# Altium schematic sheet power.SchDoc
size Letter
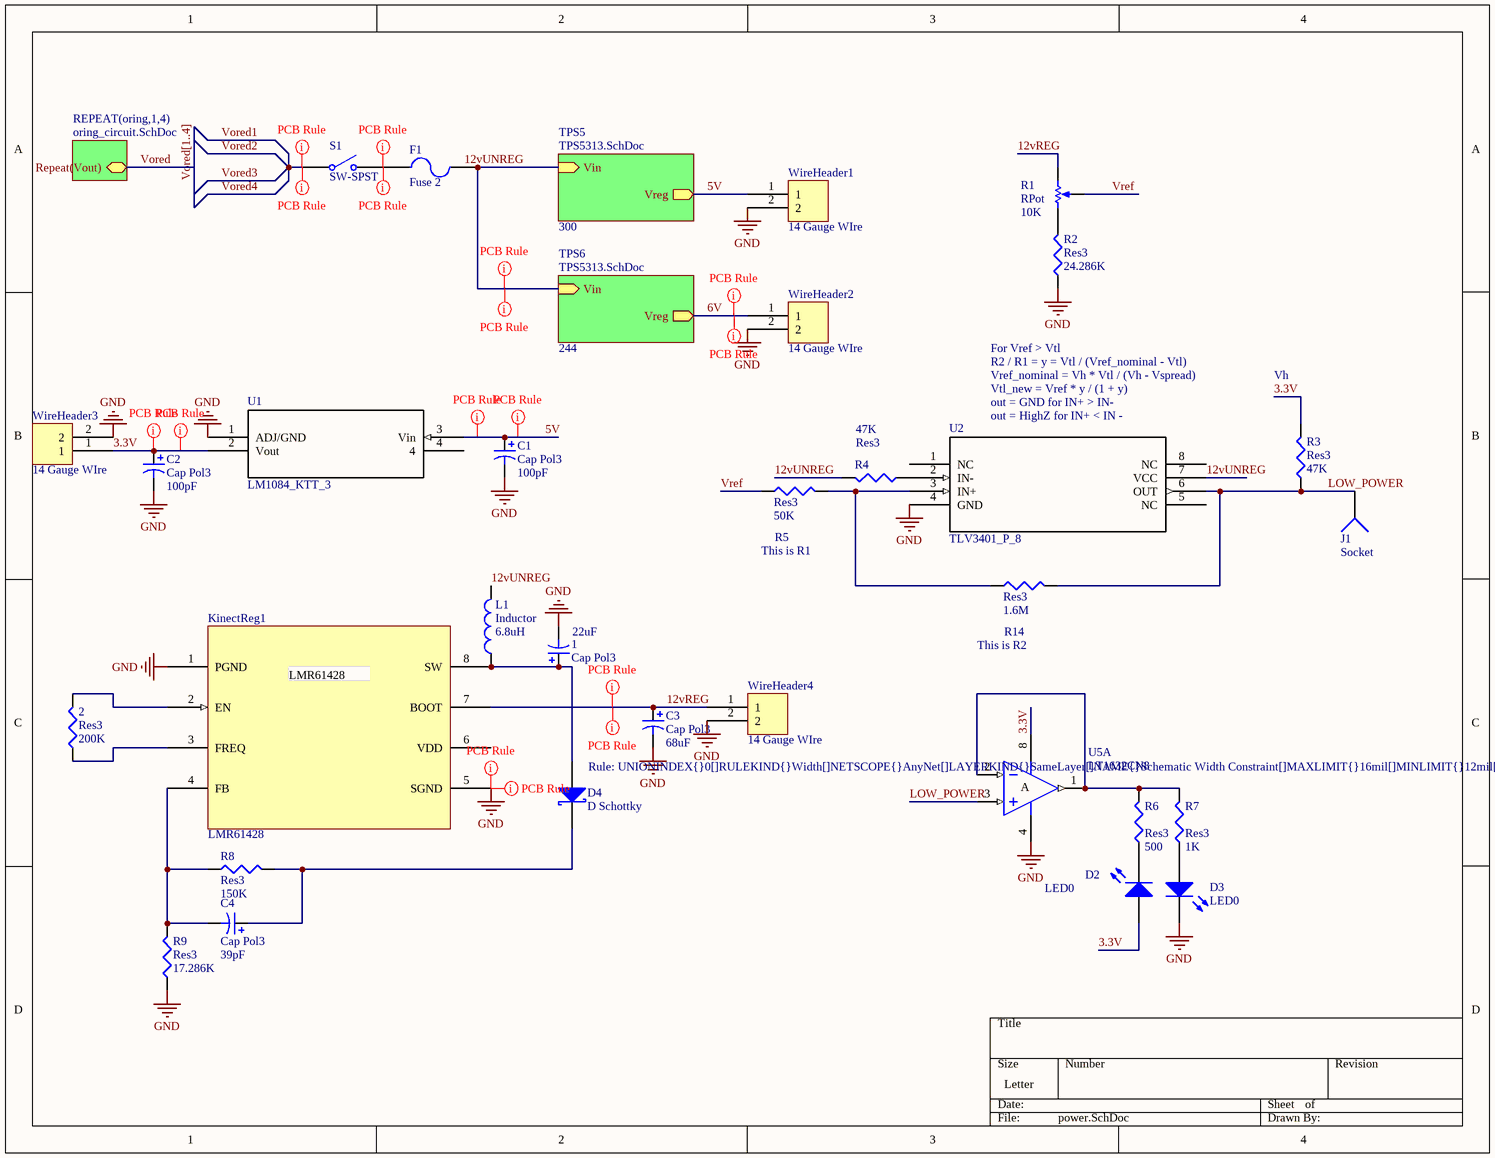
[diagram p0: power.SchDoc]

## Parts
1  Cap Pol3  value 22uF  [C0805]
2  Res3  value 200K  [6-0805_M]
C1  Cap Pol3  value 100pF  [C0805]
C2  Cap Pol3  value 100pF  [C0805]
C3  Cap Pol3  value 68uF  [C0805]
C4  Cap Pol3  value 39pF  [C0805]
D2  LED0  [LED-0]
D3  LED0  [LED-0]
D4  D Schottky  [AXIAL-0.3]
F1  Fuse 2  [PIN-W2/E2.8]
J1  Socket  [PIN1]
KinectReg1  LMR61428  [D8]
L1  Inductor  value 6.8uH  [6-0805_L]
R1  RPot  value 10K  [RPot]
R2  Res3  value 24.286K  [6-0805_M]
R3  Res3  value 47K  [6-0805_M]
R4  Res3  value 47K  [6-0805_M]
R5  Res3  value 50K  [6-0805_M]
R6  Res3  value 500  [6-0805_M]
R7  Res3  value 1K  [6-0805_M]
R8  Res3  value 150K  [6-0805_M]
R9  Res3  value 17.286K  [6-0805_M]
R14  Res3  value 1.6M  [6-0805_M]
S1  SW-SPST  [switch]
U1  LM1084_KTT_3  [TS3B]
U2  TLV3401_P_8  [P8]
U5  LT1632CN8  [P8]  (part A of 2)
WireHeader1  14 Gauge WIre  [WireHeader]
WireHeader2  14 Gauge WIre  [WireHeader]
WireHeader3  14 Gauge WIre  [WireHeader]
WireHeader4  14 Gauge WIre  [WireHeader]

## Sub-sheets
REPEAT(oring,1,4) = oring_circuit.SchDoc: Repeat(Vout)
TPS5 = TPS5313.SchDoc: Vreg (out), Vin (in)  | R2_Value: 300
TPS6 = TPS5313.SchDoc: Vreg (out), Vin (in)  | R2_Value: 244

## Nets
GND: 1.2 C1.2 C2.2 C3.2 D3.2(K) KinectReg1.1(PGND) KinectReg1.5(SGND) R2.1 R9.1 U1.1(ADJ/GND) U2.4(GND) U5.4(V-) WireHeader1.2 WireHeader2.2 WireHeader3.2 WireHeader4.2
3.3V: C2.1 D2.1(A) R3.2 U1.2(Vout) U5.8(V+) WireHeader3.1
5V: C1.1 U1.3(Vin) WireHeader1.1 ; sheet TPS5/Vreg
6V: WireHeader2.1 ; sheet TPS6/Vreg
12vREG: C3.1 KinectReg1.7(BOOT) R1.2(BOT) WireHeader4.1
12vUNREG: L1.2 R4.2 U2.7(VCC)
LOW_POWER: J1.1 R3.1 R14.2 U2.6(OUT) U5.3(IN+)
Vored: sheet REPEAT(oring,1,4)/Repeat(Vout)
Vored1: S1.1(COMMON)  [also labelled Vored2, Vored3, Vored4]
Vref: R1.3(TAP) R5.1
Net1_1: 1.1 D4.1(A) KinectReg1.8(SW) L1.1
Net2_1: 2.1 KinectReg1.3(FREQ)
Net2_2: 2.2 KinectReg1.2(EN)
NetC4_1: C4.1 D4.2(K) R8.2
NetC4_2: C4.2 KinectReg1.4(FB) R8.1 R9.2
NetD2_2: D2.2(K) R6.1
NetD3_1: D3.1(A) R7.1
NetF1_1: F1.1 S1.2(NO)
NetF1_2: F1.2 ; sheet TPS5/Vin, sheet TPS6/Vin
NetR1_1: R1.1(TOP) R2.2
NetR4_1: R4.1 U2.2(IN-)
NetR5_2: R5.2 R14.1 U2.3(IN+)
NetR6_2: R6.2 R7.2 U5.1(OUT) U5.2(IN-)

Not connected (* = marked no-connect by the designer): KinectReg1 6(VDD); U1 4; U2 1(NC) 5(NC) 8(NC)

## Buses and harness runs
bus Vored[1..4]

## Layout directives
rule Width Constraint [Pref Width = 15mil    Min Width = 12mil    Max Width = 16mil]: 12vREG
rule Undefined; rule Width Constraint [Pref Width = 30mil    Min Width = 30mil    Max Width = 30mil]: 3.3V
rule Width Constraint [Pref Width = 40mil    Min Width = 40mil    Max Width = 40mil]: 5V, 6V, NetF1_1, NetF1_2, Vored1
rule Width Constraint [Pref Width = 15mil    Min Width = 15mil    Max Width = 15mil]: GND
rule Undefined; rule Clearance Constraint [Clearance = 30mil]: 3.3V, 5V, 6V, 12vREG, GND, NetF1_1, NetF1_2, Vored1

## Notes on the sheet
- R2 / R1 = y = Vtl / (Vref_nominal - Vtl)
- For Vref > Vtl
- out = GND for IN+ > IN-
- (near U2) out = HighZ for IN+ < IN -
- Vtl_new = Vref * y / (1 + y)
- Vref_nominal = Vh * Vtl / (Vh - Vspread)
- Vh
- This is R1
- This is R2
- Labels drawn without touching a wire or pin: 12vUNREG
- (in symbol LT1632CN8, part A) A

## Library data of the parts
1 C1-C4 = Cap Pol3: Polarized Capacitor (Surface Mount); Published: 8-Jun-2000; LatestRevisionDate: 29-May-2009; LatestRevisionNote: IPC-7351 Footprint Added.; PackageReference: C0805; Publisher: Altium Limited; PackageDescription: Chip Capacitor
2 R2-R9 R14 = Res3: Resistor; Published: 8-Jun-2000; LatestRevisionDate: 29-May-2009; LatestRevisionNote: IPC-7351 Footprint Added.; PackageReference: J1-0603; Publisher: Altium Limited; PackageDescription: Chip Resistor
D2 D3 = LED0: Typical INFRARED GaAs LED; Published: 8-Jun-2000; LatestRevisionDate: 08-Jul-2005; LatestRevisionNote: Mech Layer 1 removed.; PackageReference: LED-0; Publisher: Altium Limited; PackageDescription: LED; 2 Leads
D4 = D Schottky: Schottky Diode; Published: 8-Jun-2000; LatestRevisionDate: 17-Jul-2002; LatestRevisionNote: Re-released for DXP Platform.; PackageReference: SMB; Publisher: Altium Limited; PackageDescription: DO-214-AA/SMB; 2 C-Bend Leads; Body 5.3 x 3.6 mm, inc. leads (LxW); Code_JEDEC: DO-214-AA
F1 = Fuse 2: Fuse; Published: 8-Jun-2000; LatestRevisionDate: 17-Jul-2002; LatestRevisionNote: Re-released for DXP Platform.; PackageReference: PIN-W2/E2.8; Publisher: Altium Limited; PackageDescription: Thru-Hole; 2 Leads
L1 = Inductor: Code_IEC: 1005; Published: 8-Jun-2000; LatestRevisionDate: 29-May-2009; LatestRevisionNote: IPC-7351 Footprint Added.; PackageReference: 0402-A; Publisher: Altium Limited; PackageDescription: Chip Inductor; Code_JEITA: 0402
R1 = RPot: Potentiometer; Sim Note: Enter the Resistance value and the set point into parameter fields.; Set Position: 0.5; Published: 8-Jun-2000; LatestRevisionDate: 17-Jul-2002; LatestRevisionNote: Re-released for DXP Platform.; PackageReference: VR5; Publisher: Altium Limited; PackageDescription: Variable Resistor, Thru-Hole; 3 Leads
S1 = SW-SPST: Single-Pole, Single-Throw Switch; Published: 24-Mar-1999; LatestRevisionDate: 17-Jul-2002; LatestRevisionNote: Re-released for DXP Platform.; PackageReference: SPST-2; Publisher: Altium Limited; PackageDescription: Switch; 2 Leads
U1 = LM1084_KTT_3: Imported; PartNumber: LM1084IS-33; Comp: TypeLDO; Vendor: NationalSemiconductor; base_pn: LM1084; Symbol: NameLM1084IS-33; Library: ReferenceLM1084IS; Type: DEV; Version: 1; Pin: Count3; RefDes: RefDes; Value: Value
U2 = TLV3401_P_8: Imported; Vendor: Texas Instruments; PACKAGE_DESIGNATOR: P; PIN_COUNT: 8; FAMILY_NAME: COMPARATOR; INDUSTRY_STD_PKG_TYPE: PDIP; Manufacturer_Part_Number: tlv3401_p_8; GENERIC_PART_NUMBER: TLV3401; Datasheet URL: http://www.ti.com/lit/gpn/TLV3401; Manufacturer: Texas Instruments; RefDes: RefDes; Type: DEV; Value: Value
U5 = LT1632CN8: 45MHz, 45V/µs, Dual Rail-to-Rail Input and Output Precision Operational Amplifier; Note: 1455; Published: 8-Jun-2000; LatestRevisionDate: 29-May-2009; LatestRevisionNote: Component Body Added.; DatasheetVersion: 1996; PackageVersion: N8 1002; PackageReference: N8; Publisher: Altium Limited; PackageDescription: DIP, Plastic, 8-Pin, Row Spacing 7.62 mm, Pitch 2.54 mm; ComponentLink1Description: Manufacturer Link; ComponentLink1URL: http://www.linear.com/; ComponentLink2Description: Datasheet; ComponentLink2URL: http://www.linear.com/pc/downloadDocument.do?navId=H0,C1,C1154,C1009,C1022,P1642,D3055
WireHeader1-WireHeader4 = WireHeader
J1 = Socket: LatestRevisionDate: 17-Jul-2002; LatestRevisionNote: Re-released for DXP Platform.; Publisher: Altium Limited